# Altium schematic sheet ESP12_PCB.SchDoc: ESP8266 ESP12 PCB
size A4; DocumentNumber: ESP12_PCB_V1.0; Revision: V1.0
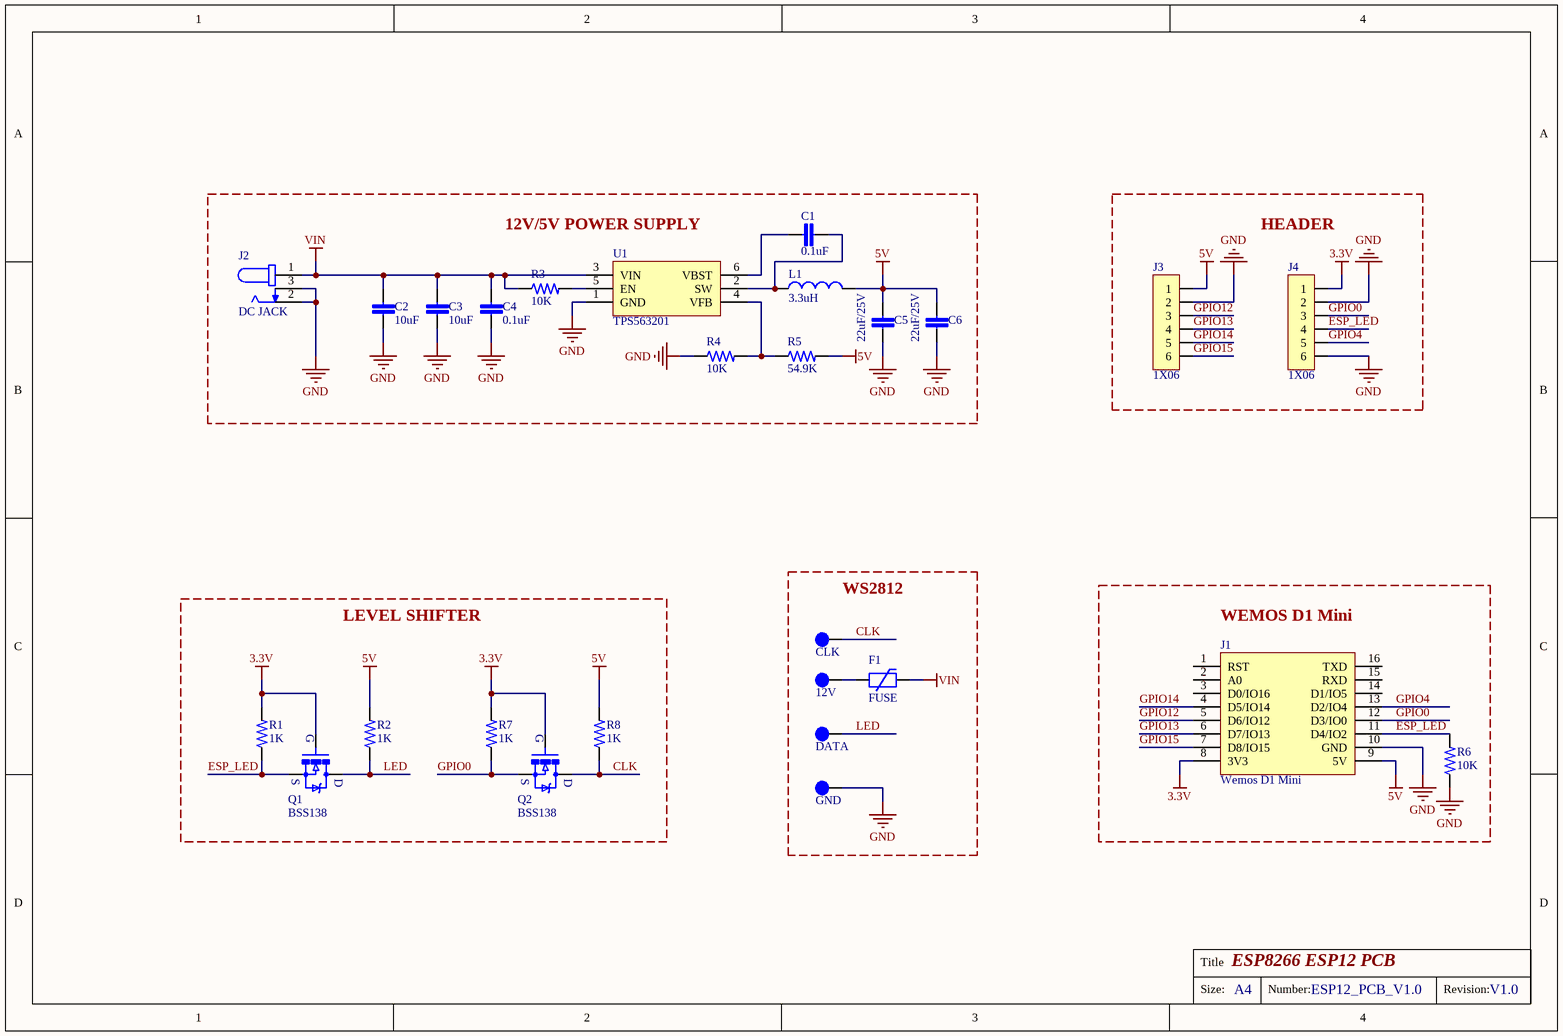
[diagram p0: ESP12_PCB.SchDoc]

## Parts
12V  TestPoint  [TestPoint]  (value not drawn)  (no BOM)
C1  0.1uF  [C1206]
C2  10uF  [C1206]
C3  10uF  [C1206]
C4  0.1uF  [C1206]
C5  22uF/25V  [C1206]
C6  22uF/25V  [C1206]
CLK  TestPoint  [TestPoint]  (value not drawn)  (no BOM)
DATA  TestPoint  [TestPoint]  (value not drawn)  (no BOM)
F1  FUSE  [FUSE-SMD_L8.0-W5.4]
GND  TestPoint  [TestPoint]  (value not drawn)  (no BOM)
J1  Wemos D1 Mini  [WEMOS_D1_MINI]
J2  DC JACK  [CUI_PJ-002A]
J3  1X06  [CON_1X06_2.54MM_MALE]
J4  1X06  [CON_1X06_2.54MM_MALE]
L1  3.3uH  [IND_5X5]
Q1  BSS138  [SOT23-3]
Q2  BSS138  [SOT23-3]
R1  1K  [R1206]
R2  1K  [R1206]
R3  10K  [R1206]
R4  10K  [R1206]
R5  54.9K  [R1206]
R6  10K  [R1206]
R7  1K  [R1206]
R8  1K  [R1206]
U1  TPS563201  [SOT23-6]

## Blocks framed on the sheet
12V/5V POWER SUPPLY: C1-C6 J2 L1 R3-R5 U1
HEADER: J3 J4
LEVEL SHIFTER: Q1 Q2 R1 R2 R7 R8
WS2812: 12V CLK DATA F1 GND
WEMOS D1 Mini: J1 R6

## Nets
3.3V: J1.8(3V3) J4.1 Q1.1(G) Q2.1(G) R1.2 R7.2
5V: C5.1 C6.1 J1.9(5V) J3.1 L1.2 R2.2 R5.2 R8.2
GND: C2.2 C3.2 C4.2 C5.2 C6.2 GND.1 J1.10(GND) J2.2 J2.3 J3.2 J4.2 J4.6 R4.1 R6.1 U1.1(GND)
VIN: C2.1 C3.1 C4.1 F1.2 J2.1 R3.1 U1.3(VIN)
CLK: CLK.1 Q2.3(D) R8.1
ESP_LED: J1.11(D4/IO2) J4.4 Q1.2(S) R1.1 R6.2
GPIO0: J1.12(D3/IO0) J4.3 Q2.2(S) R7.1
GPIO4: J1.13(D2/IO4) J4.5
GPIO12: J1.5(D6/IO12) J3.3
GPIO13: J1.6(D7/IO13) J3.4
GPIO14: J1.4(D5/IO14) J3.5
GPIO15: J1.7(D8/IO15) J3.6
LED: DATA.1 Q1.3(D) R2.1
Net12V_1: 12V.1 F1.1
NetC1_1: C1.1 U1.6(VBST)
NetC1_2: C1.2 L1.1 U1.2(SW)
NetR3_2: R3.2 U1.5(EN)
NetR4_2: R4.2 R5.1 U1.4(VFB)

Not connected (* = marked no-connect by the designer): J1 1(RST) 2(A0) 3(D0/IO16) 14(D1/IO5) 15(RXD) 16(TXD)

## Notes on the sheet
- Title
- Size:
- A4
- Number:
- Revision:

## Library data of the parts
12V CLK DATA GND = TestPoint: Test Point
C1 C4 = C1206_0.1uF_50V: 0.1µF ±10% 50V Ceramic Capacitor X7R 1206 (3216 Metric); Manufacturer: Samsung; Manufacturer Part Number: CL31B104KBCNFNC; Capacitance: 100nF; Supplier 1: Digi-Key; Stock 1: 134564; Pricing 1: 1=0.12, 10=0.086, 100=0.0403, 500=0.02824, 1000=0.02338 (USD); Mount: Surface Mount; Case/Package: 1206; Case Code (Metric): 3216; Case Code (Imperial): 1206; Min Operating Temperature: -55°C; Max Operating Temperature: 125°C; Package Quantity: 1; Packaging: Tape and Reel; Tolerance: 10%; Voltage Rating: 50V; Dielectric: X7R; Length: 0.126inch; Height: 0.85mm; Width: 0.063inch; Thickness: 0.037inch; Depth: 1.6mm; Radiation Hardening: No; ComponentLink1URL: https://media.digikey.com/pdf/Data%20Sheets/Samsung%20PDFs/CL_Series_MLCC_ds.pdf?src-supplier=Digi-Key; ComponentLink1Description: https://media.digikey.com/pdf/Data%20Sheets/Samsung%20PDFs/CL_Series_MLCC_ds.pdf?src-supplier=Digi-Key; Supplier Part Number 1: 1276-2744-1-ND
C2 C3 = C1206_10uF_16V: 10µF -20%, +80% 16V Ceramic Capacitor Y5V (F) 1206 (3216 Metric); Manufacturer: Samsung; Manufacturer Part Number: CL31F106ZOHNNNE; Tolerance: 80%; Supplier 1: Digi-Key; Supplier Part Number 1: 1276-1312-1-ND; Stock 1: 142848; Pricing 1: 1=0.25, 10=0.169, 100=0.096, 500=0.06778, 1000=0.0593 (USD); Mount: Surface Mount; Case/Package: 1206; Case Code (Metric): 3216; Case Code (Imperial): 1206; Material: Ceramic; Min Operating Temperature: -30°C; Max Operating Temperature: 85°C; Capacitance: 10uF; Dielectric: Y5V; Packaging: Tape and Reel; Voltage Rating: 16V; Voltage Rating (DC): 16V; Length: 3.2mm; Height: 1.6mm; Width: 0.063inch; Thickness: 0.071inch; Depth: 1.6mm; Radiation Hardening: No; Lead Free: Lead Free; ComponentLink1URL: https://www.verical.com/server-webapp/html/getDatasheet?partID=354118&src-supplier=Verical; ComponentLink1Description: https://www.verical.com/server-webapp/html/getDatasheet?partID=354118&src-supplier=Verical; ComponentLink2URL: http://www1.futureelectronics.com/doc/SAMSUNG%20PASSIVE/CL05B104KQ5NNNC.pdf?src-supplier=Future+Electronics; ComponentLink2Description: http://www1.futureelectronics.com/doc/SAMSUNG%20PASSIVE/CL05B104KQ5NNNC.pdf?src-supplier=Future+Electronics; ComponentLink3URL: https://produktinfo.conrad.com/datenblaetter/450000-474999/452562-da-01-en-VS_KONDENSATOR_1206.pdf?src-supplier=Conrad; ComponentLink3Description: https://produktinfo.conrad.com/datenblaetter/450000-474999/452562-da-01-en-VS_KONDENSATOR_1206.pdf?src-supplier=Conrad
C5 C6 = C1206_22uF_25V: Cap Ceramic 22uF 25V X5R 10% SMD 1206 85C Embossed T/R; Manufacturer: Samsung; Manufacturer Part Number: CL31A226KAHNNNE; Supplier 1: Digi-Key; Supplier Part Number 1: 1276-3047-1-ND; Stock 1: 1010193; Pricing 1: 1=0.62, 10=0.439, 100=0.289, 500=0.21406, 1000=0.18195 (USD); Mount: Surface Mount; Case/Package: 1206; Case Code (Metric): 3216; Case Code (Imperial): 1206; Material: Ceramic; Contact Plating: Tin; Min Operating Temperature: -55°C; Max Operating Temperature: 85°C; Capacitance: 22uF; Tolerance: 10%; Dielectric: X5R; Package Quantity: 1; Packaging: Tape and Reel; Voltage Rating: 25V; Length: 3.2mm; Height: 1.6mm; Width: 0.063inch; Thickness: 0.071inch; Depth: 1.6mm; Radiation Hardening: No; ComponentLink1URL: https://media.digikey.com/pdf/Data%20Sheets/Samsung%20PDFs/CL_Series_MLCC_ds.pdf?src-supplier=Digi-Key; ComponentLink1Description: https://media.digikey.com/pdf/Data%20Sheets/Samsung%20PDFs/CL_Series_MLCC_ds.pdf?src-supplier=Digi-Key; ComponentLink2URL: https://www.verical.com/server-webapp/html/getDatasheet?partID=359658&src-supplier=Verical; ComponentLink2Description: https://www.verical.com/server-webapp/html/getDatasheet?partID=359658&src-supplier=Verical; ComponentLink3URL: http://www1.futureelectronics.com/doc/SAMSUNG/CL31A226KAHNNNE.pdf?src-supplier=Future+Electronics; ComponentLink3Description: http://www1.futureelectronics.com/doc/SAMSUNG/CL31A226KAHNNNE.pdf?src-supplier=Future+Electronics; ComponentLink4URL: https://produktinfo.conrad.com/datenblaetter/450000-474999/452249-da-01-en-VS_KONDENSATOR_1206.pdf?src-supplier=Conrad; ComponentLink4Description: https://produktinfo.conrad.com/datenblaetter/450000-474999/452249-da-01-en-VS_KONDENSATOR_1206.pdf?src-supplier=Conrad
F1 = FUSE: 16V 10A 2920 PTC Resettable Fuses RoHS; Manufacturer Part Number: SMD2920P500TF/16
J1 = Wemos_D1_Mini: Wemos D1 Mini Wireless WIFI Internet of Things Development Board Based ESP8266 CH340 CH340G 4MB For Arduino Nodemcu V2 V3.0 3.0
J2 = DC_JACK_PJ-002A: Power Barrel Connector Jack 2.10mm ID (0.083"), 5.50mm OD (0.217") Through Hole, Right Angle; Manufacturer: CUI; Gender: Male; Shielding: Unshielded; Current Rating: 2.5A; Number of Conductors: 2; Voltage Rating: 24V; Insulation Resistance: 50MR; Supplier 1: Digi-Key; Supplier Part Number 1: CP-002A-ND; Manufacturer Part Number: PJ-002A; Stock 1: 57905; Pricing 1: 1=0.6, 10=0.558, 25=0.5024, 50=0.4464, 100=0.4278, 250=0.3906, 500=0.372, 1000=0.3069, 2500=0.279 (USD); Mount: Through Hole; Color: Black; Contact Material: Copper Alloy,Copper; Contact Plating: Tin,Nickel; Housing Material: Thermoplastic; Housing Color: Black; Min Operating Temperature: -25°C; Max Operating Temperature: 85°C; Connector Type: Jack; Termination: Through Hole; Packaging: Bulk; Package Quantity: 500; Orientation: Horizontal; Contact Gender: Male; Diameter: 2.1mm; Lead Free: Lead Free; Flammability Rating: UL94 V-0
J3 J4 = CON_1X06_2.54mm_Male: Connector Header Through Hole 6 position 0.100" (2.54mm); Manufacturer Part Number: Z-211-0611-0021-001
L1 = INDCUTOR_3.3uH: 3.3µH Shielded Wirewound Inductor 2.02A 96mOhm Max Nonstandard; Manufacturer: TDK; Manufacturer Part Number: VLCF5020T-3R3N2R0-1; Core Material: Ferrite; Tolerance: 30%; DC Resistance (DCR): 96mR; Test Frequency: 100kHz; Supplier 1: Digi-Key; Supplier Part Number 1: 445-3206-1-ND; Stock 1: 166; Pricing 1: 1=0.97, 10=0.845, 100=0.6038 (USD); Mount: Surface Mount; Case/Package: Nonstandard; Number of Pins: 2; Min Operating Temperature: -40°C; Max Operating Temperature: 105°C; Inductance: 3.3uH; Packaging: Tape and Reel; Inductance Tolerance: 30%; Package Quantity: 500; Current Rating: 2.02A; Saturation Current: 2.02A; Shielding: Shielded; Composition: Wirewound; Max DC Current: 2.02A; Termination: SMD/SMT; RMS Current (Irms): 2.02A; DC Current: 2.02A; Military Standard: Not; Length: 0.197inch; Height: 2mm; Depth: 5.2mm; Width: 0.197inch; Height - Seated (Max): 0.079inch; REACH SVHC: Unknown; Lead Free: Lead Free; ComponentLink1URL: http://www.farnell.com/datasheets/516785.pdf?src-supplier=Element14; ComponentLink1Description: http://www.farnell.com/datasheets/516785.pdf?src-supplier=Element14; ComponentLink2URL: http://www.farnell.com/datasheets/516785.pdf?src-supplier=Farnell; ComponentLink2Description: http://www.farnell.com/datasheets/516785.pdf?src-supplier=Farnell; ComponentLink3URL: http://uk.rs-online.com/webdocs/1538/0900766b81538dbe.pdf?src-supplier=RSComponents; ComponentLink3Description: http://uk.rs-online.com/webdocs/1538/0900766b81538dbe.pdf?src-supplier=RSComponents; ComponentLink4URL: http://www.onlinecomponents.com/productFiles/mf-TDK/e531_vlcf5020_1.pdf?src-supplier=Onlinecomponents.com; ComponentLink4Description: http://www.onlinecomponents.com/productFiles/mf-TDK/e531_vlcf5020_1.pdf?src-supplier=Onlinecomponents.com
Q1 Q2 = BSS138-7-F: N-Channel MOSFET 50V 200mA (Ta) 300mW (Ta) Surface Mount SOT-23-3; Manufacturer: Diodes; Nominal Vgs: 1.2V; Gate to Source Voltage (Vgs): 20V; Rds On Max: 3.5R; Input Capacitance: 50pF; Number of Elements: 1; Turn-Off Delay Time: 20ns; Element Configuration: Single; Fall Time: 25ns; Rise Time: 10ns; Supplier 1: Digi-Key; Supplier Part Number 1: BSS138-FDICT-ND; Manufacturer Part Number: BSS138-7-F; Stock 1: 1498304; Pricing 1: 1=0.2, 10=0.168, 100=0.0686, 500=0.05726, 1000=0.03978 (USD); Mount: Surface Mount; Case/Package: SOT-23; Number of Pins: 3; Weight: 0.000282oz; Contact Plating: Tin,Matte; Min Operating Temperature: -55°C; Max Operating Temperature: 150°C; Continuous Drain Current (ID): 200mA; Max Power Dissipation: 300mW; Drain to Source Voltage (Vdss): 50V; Packaging: Tape and Reel; Package Quantity: 3000; Drain to Source Breakdown Voltage: 50V; Drain to Source Resistance: 3.5R; Power Dissipation: 300mW; Turn-On Delay Time: 20ns; Threshold Voltage: 1.2V; Number of Channels: 1; Voltage Rating (DC): 50V; Current Rating: 200mA; On-State Resistance: 3.5R; Voltage: 50V; Length: 2.9mm; Height: 1mm; Width: 1.3mm; REACH SVHC: No SVHC; Lead Free: Lead Free; ComponentLink1URL: http://www.diodes.com/datasheets/BSS138.pdf?src-supplier=Avnet; ComponentLink1Description: http://www.diodes.com/datasheets/BSS138.pdf?src-supplier=Avnet; ComponentLink2URL: http://www.farnell.com/datasheets/1915619.pdf?src-supplier=Element14; ComponentLink2Description: http://www.farnell.com/datasheets/1915619.pdf?src-supplier=Element14; ComponentLink3URL: http://www.diodes.com/datasheets/BSS138.pdf?src-supplier=Avnet+Europe; ComponentLink3Description: http://www.diodes.com/datasheets/BSS138.pdf?src-supplier=Avnet+Europe; ComponentLink4URL: https://www.diodes.com/assets/Datasheets/ds30144.pdf?src-supplier=Digi-Key; ComponentLink4Description: https://www.diodes.com/assets/Datasheets/ds30144.pdf?src-supplier=Digi-Key; ComponentLink5URL: http://www.diodes.com/_files/datasheets/ds30144.pdf?src-supplier=Future+Electronics; ComponentLink5Description: http://www.diodes.com/_files/datasheets/ds30144.pdf?src-supplier=Future+Electronics
R1 R2 R7 R8 = R1206_1K: 1 kOhms ±1% 0.25W, 1/4W Chip Resistor 1206 (3216 Metric) Automotive AEC-Q200, Moisture Resistant Thick Film; Manufacturer: Yageo; Manufacturer Part Number: AC1206FR-071KL; Voltage Rating: 200V; Power Rating: 250mW; Resistance: 1kR; Temperature Coefficient: 100ppm/°C; Supplier 1: Digi-Key; Supplier Part Number 1: YAG3829CT-ND; Stock 1: 469087; Pricing 1: 1=0.1, 10=0.077, 100=0.0296, 1000=0.01302, 2500=0.01125 (USD); Case/Package: 1206; Weight: 0.000571oz; Case Code (Imperial): 1206; Case Code (Metric): 3016; Min Operating Temperature: -55°C; Max Operating Temperature: 155°C; Packaging: Tape and Reel; Tolerance: 1%; Composition: Thick Film; Number of Terminations: 2; Termination: SMD/SMT; Max Power Dissipation: 250mW; Features: Moisture Resistant,Automotive AEC-Q200; Length: 0.122inch; Height: 0.026inch; Width: 0.063inch; ComponentLink1URL: http://www.yageo.com/NewPortal/yageodocoutput?fileName=/pdf/R-Chip/PYu-AC_51_RoHS_L_6.pdf&src-supplier=Digi-Key; ComponentLink1Description: http://www.yageo.com/NewPortal/yageodocoutput?fileName=/pdf/R-Chip/PYu-AC_51_RoHS_L_6.pdf&src-supplier=Digi-Key; ComponentLink2URL: http://www.mouser.com/ds/2/447/yageodocoutput-1111992.pdf?src-supplier=Mouser; ComponentLink2Description: http://www.mouser.com/ds/2/447/yageodocoutput-1111992.pdf?src-supplier=Mouser
R3 R4 R6 = R1206_10K: 10 kOhms ±5% 0.25W, 1/4W Chip Resistor 1206 (3216 Metric) Moisture Resistant Thick Film; Manufacturer: Yageo; Manufacturer Part Number: RC1206JR-0710KL; Resistance: 10kR; Temperature Coefficient: 100ppm/°C; Power Rating: 250mW; Voltage Rating: 200V; Supplier 1: Digi-Key; Supplier Part Number 1: 311-10KERCT-ND; Stock 1: 5252312; Pricing 1: 1=0.1, 10=0.061, 100=0.0249, 1000=0.01118, 2500=0.00971 (USD); Case/Package: 1206; Case Code (Imperial): 1206; Case Code (Metric): 3216; Min Operating Temperature: -55°C; Max Operating Temperature: 155°C; Composition: Thick Film; Tolerance: 5%; Packaging: Tape and Reel; Package Quantity: 5000; Termination: SMD/SMT; Number of Terminations: 2; Military Standard: Not; Max Power Dissipation: 250mW; Working Voltage: 200V; Length: 0.122inch; Height: 0.026inch; Width: 0.063inch; Depth: 1.6mm; REACH SVHC: Unknown; Lead Free: Lead Free; ComponentLink1URL: http://www.farnell.com/datasheets/444357.pdf?src-supplier=Element14; ComponentLink1Description: http://www.farnell.com/datasheets/444357.pdf?src-supplier=Element14; ComponentLink2URL: http://www.yageo.com/documents/recent/PYu-RC_Group_51_RoHS_L_10.pdf?src-supplier=Digi-Key; ComponentLink2Description: http://www.yageo.com/documents/recent/PYu-RC_Group_51_RoHS_L_10.pdf?src-supplier=Digi-Key; ComponentLink3URL: https://produktinfo.conrad.com/datenblaetter/400000-424999/402664-da-01-en-SMD_Widerstand_Chip1206_10_kOhm.pdf?src-supplier=Conrad; ComponentLink3Description: https://produktinfo.conrad.com/datenblaetter/400000-424999/402664-da-01-en-SMD_Widerstand_Chip1206_10_kOhm.pdf?src-supplier=Conrad
R5 = R1206_54.9K: 54.9 kOhms ±1% 0.25W, 1/4W Chip Resistor 1206 (3216 Metric) Moisture Resistant Thick Film; Manufacturer: Yageo; Manufacturer Part Number: RC1206FR-0754K9L; Resistance: 54.9kR; Temperature Coefficient: 100ppm/°C; Power Rating: 250mW; Voltage Rating: 200V; Supplier 1: Digi-Key; Supplier Part Number 1: 311-54.9KFRCT-ND; Stock 1: 25794; Pricing 1: 1=0.1, 10=0.071, 100=0.0291, 1000=0.01306, 2500=0.01134 (USD); Case/Package: 1206; Contact Plating: Tin,Matte; Case Code (Imperial): 1206; Case Code (Metric): 3216; Min Operating Temperature: -55°C; Max Operating Temperature: 155°C; Tolerance: 1%; Composition: Thick Film; Packaging: Tape and Reel; Termination: SMD/SMT; Military Standard: Not; Voltage Rating (DC): 200V; Length: 3.1mm; Height: 0.55mm; Width: 1.6mm; Depth: 1.6mm; Radiation Hardening: No; Lead Free: Lead Free; ComponentLink1URL: http://www.yageo.com/documents/recent/PYu-RC_Group_51_RoHS_L_2.pdf?src-supplier=Avnet; ComponentLink1Description: http://www.yageo.com/documents/recent/PYu-RC_Group_51_RoHS_L_2.pdf?src-supplier=Avnet; ComponentLink2URL: http://www.yageo.com/documents/recent/PYu-RC1206_51_RoHS_L-4.pdf?src-supplier=Future+Electronics; ComponentLink2Description: http://www.yageo.com/documents/recent/PYu-RC1206_51_RoHS_L-4.pdf?src-supplier=Future+Electronics; ComponentLink3URL: http://www.yageo.com.tw/exep/pages/download/literatures/PYu-R_INT-thick_7.pdf?src-supplier=Digi-Key; ComponentLink3Description: http://www.yageo.com.tw/exep/pages/download/literatures/PYu-R_INT-thick_7.pdf?src-supplier=Digi-Key; ComponentLink4URL: http://www.yageo.com/documents/recent/PYu-RC_Group_51_RoHS_L_10.pdf?src-supplier=Digi-Key; ComponentLink4Description: http://www.yageo.com/documents/recent/PYu-RC_Group_51_RoHS_L_10.pdf?src-supplier=Digi-Key; ComponentLink5URL: http://www.yageo.com/documents/recent/PYu-RC1206_51_RoHS_L_5.pdf?src-supplier=Avnet+Europe; ComponentLink5Description: http://www.yageo.com/documents/recent/PYu-RC1206_51_RoHS_L_5.pdf?src-supplier=Avnet+Europe; ComponentLink6URL: http://www.mouser.com/ds/2/447/PYu-RC1206_51_RoHS_L-4-349080.pdf?src-supplier=Mouser; ComponentLink6Description: http://www.mouser.com/ds/2/447/PYu-RC1206_51_RoHS_L-4-349080.pdf?src-supplier=Mouser; ComponentLink7URL: http://components.arrow.com/part/dataview/0323_03545128?src-supplier=Arrow+Europe; ComponentLink7Description: http://components.arrow.com/part/dataview/0323_03545128?src-supplier=Arrow+Europe
U1 = TPS563201DDCR: Conv DC-DC 4.5V to 17V Synchronous Step Down Single-Out 0.76V to 7V 3A 6-Pin TSOT-23 T/R; Manufacturer: Texas Instruments; Number of Outputs: 1; Min Output Voltage: 768mV; Switching Frequency: 580kHz; Synchronous Rectifier: Yes; Quiescent Current: 400uA; Output Type: Adjustable; Output Configuration: Positive; Supplier 1: Digi-Key; Supplier Part Number 1: 296-47238-1-ND; Manufacturer Part Number: TPS563201DDCR; Stock 1: 4931; Pricing 1: 1=0.84, 10=0.747, 100=0.5448, 500=0.45608, 1000=0.35473 (USD); Mount: Surface Mount; Case/Package: SOT-23-6; Number of Pins: 6; Min Operating Temperature: -40°C; Max Operating Temperature: 125°C; Packaging: Tape and Reel; Min Input Voltage: 4.5V; Max Input Voltage: 17V; Max Output Voltage: 7V; Output Current: 3A; Lead Free: Lead Free; ComponentLink1URL: http://www.ti.com/lit/ds/symlink/tps563201.pdf?src-supplier=Digi-Key; ComponentLink1Description: http://www.ti.com/lit/ds/symlink/tps563201.pdf?src-supplier=Digi-Key; ComponentLink2URL: http://www.ti.com/general/docs/suppproductinfo.tsp?distId=10&amp;gotoUrl=http%3A%2F%2Fwww.ti.com%2Flit%2Fgpn%2Ftps563201&src-supplier=Digi-Key; ComponentLink2Description: http://www.ti.com/general/docs/suppproductinfo.tsp?distId=10&amp;gotoUrl=http%3A%2F%2Fwww.ti.com%2Flit%2Fgpn%2Ftps563201&src-supplier=Digi-Key; ComponentLink3URL: http://www.ti.com/lit/gpn/tps563201?src-supplier=Mouser; ComponentLink3Description: http://www.ti.com/lit/gpn/tps563201?src-supplier=Mouser